# Altium schematic sheet SVS.SchDoc
size A
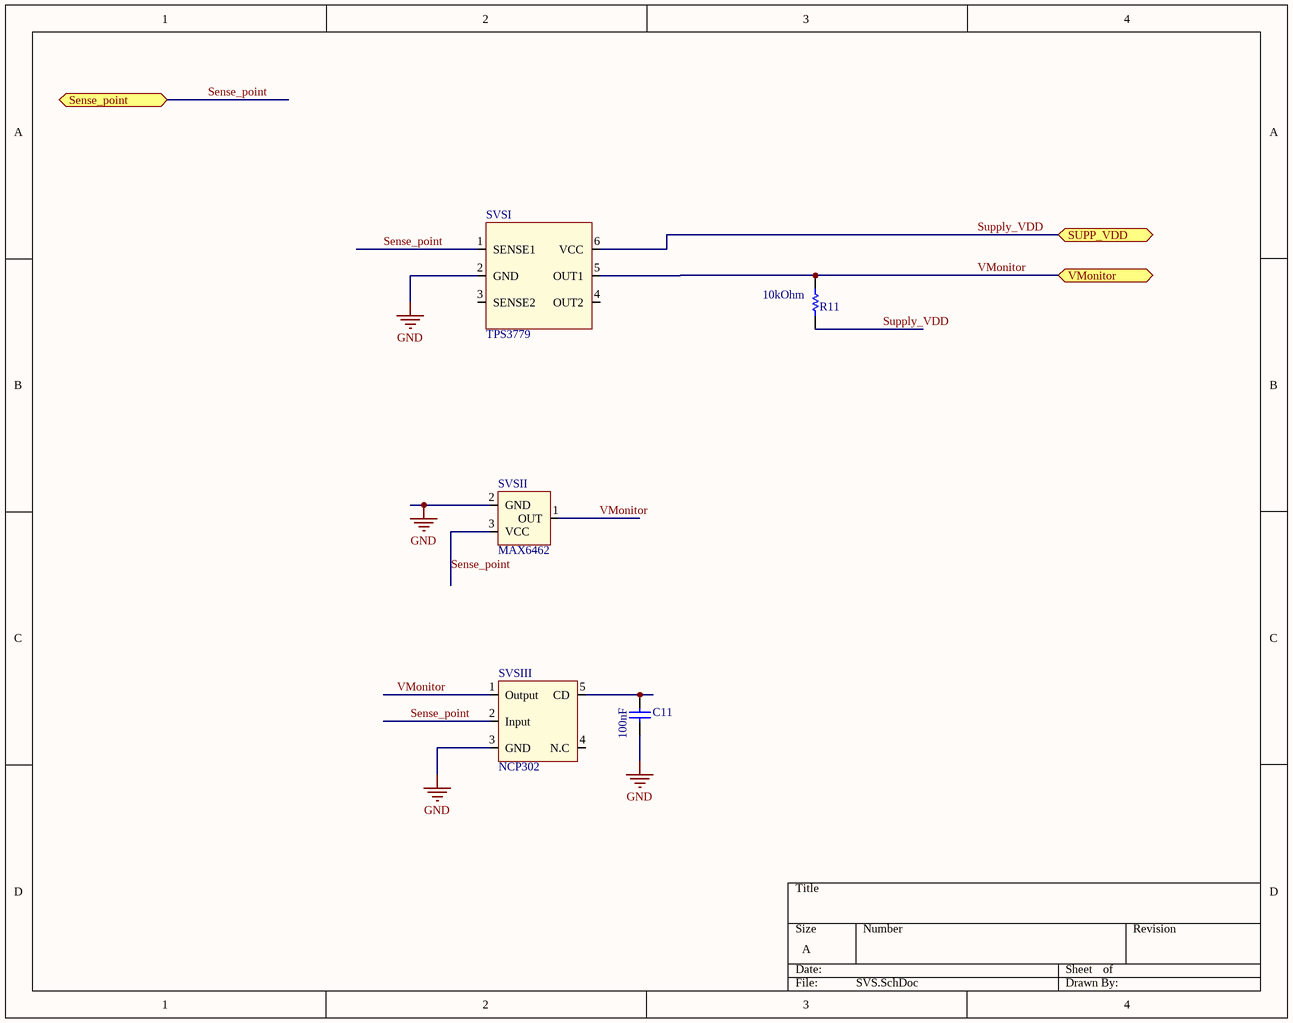
[diagram p0: SVS.SchDoc]

## Parts
C11  value 100nF  [CAPC0402(1005)60_N]  (hidden comment: CAP 1uF 4V 0402(1005))
R11  value 10kOhm  [RESC0805(2012)_M]  (hidden comment: 5R1 5% 0805(2012))
SVSI  TPS3779  [TPS3779]
SVSII  MAX6462  [MAX6462]
SVSIII  NCP302  [NCP302]

## Ports
Sense_point (bidir), SUPP_VDD (bidir), VMonitor (bidir)

## Nets
GND: C11.1 SVSI.2(GND) SVSII.2(GND) SVSIII.3(GND)
Sense_point: SVSI.1(SENSE1) SVSII.3(VCC) SVSIII.2(Input) ; port Sense_point
Supply_VDD: R11.1 SVSI.6(VCC) ; port SUPP_VDD
VMonitor: R11.2 SVSI.5(OUT1) SVSII.1(OUT) SVSIII.1(Output) ; port VMonitor
NetC11_2: C11.2 SVSIII.5(CD)

Not connected (* = marked no-connect by the designer): SVSI 3(SENSE2) 4(OUT2); SVSIII 4(N.C)

## Library data of the parts
C11 = CMP-1034-02111-1: CAP 1uF 4V ±10% 0402 (1005 Metric) Thickness 0.6mm SMD; Case-Metric: 1005; Case-EIA: 0402; Max Thickness: 0.6 mm; Technology: SMT; Tolerance: ±10%; Rated Voltage: 4 V
R11 = CMP-1013-00019-1: 5R1 0.125W 5% 0805 (2012 Metric)  SMD; Case-EIA: 0805; Case-Metric: 2012; Power: 0.125 W; Tolerance: 5 %; Technology: SMT